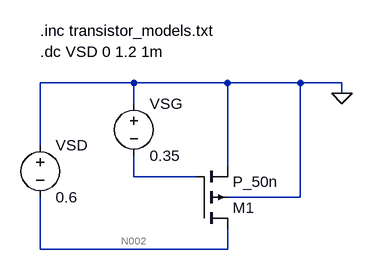
[diagram p0: schematic lab05_pmos_char.asc]
lab05_pmos_char.asc, the LTspice schematic file:
Version 4
SHEET 1 880 680
WIRE 176 32 32 32
WIRE 320 32 176 32
WIRE 432 32 320 32
WIRE 496 32 432 32
WIRE 496 48 496 32
WIRE 176 64 176 32
WIRE 32 128 32 32
WIRE 320 160 320 32
WIRE 176 176 176 144
WIRE 272 176 176 176
WIRE 432 208 432 32
WIRE 432 208 320 208
WIRE 32 288 32 208
WIRE 320 288 320 256
WIRE 320 288 32 288
FLAG 496 48 0
SYMBOL voltage 32 112 R0
WINDOW 123 0 0 Left 0
WINDOW 39 0 0 Left 0
SYMATTR InstName VSD
SYMATTR Value 0.6
SYMBOL voltage 176 48 R0
WINDOW 123 0 0 Left 0
WINDOW 39 0 0 Left 0
SYMATTR InstName VSG
SYMATTR Value 0.35
SYMBOL pmos4 272 256 M180
SYMATTR InstName M1
SYMATTR Value P_50n
SYMATTR Value2 l=1u w=10u
TEXT 32 -48 Left 2 !.inc transistor_models.txt
TEXT 32 -16 Left 2 !.dc VSD 0 1.2 1m

The netlist it stands for:
* lab05_pmos_char.asc
VSD 0 N002 0.6
VSG 0 N001 0.35
M1 N002 N001 0 0 P_50n l=1u w=10u
.model NMOS NMOS
.model PMOS PMOS
.lib standard.mos
.inc transistor_models.txt
.dc VSD 0 1.2 1m
.backanno
.end

* Results of the author's LTspice run, read from the files saved beside the schematic
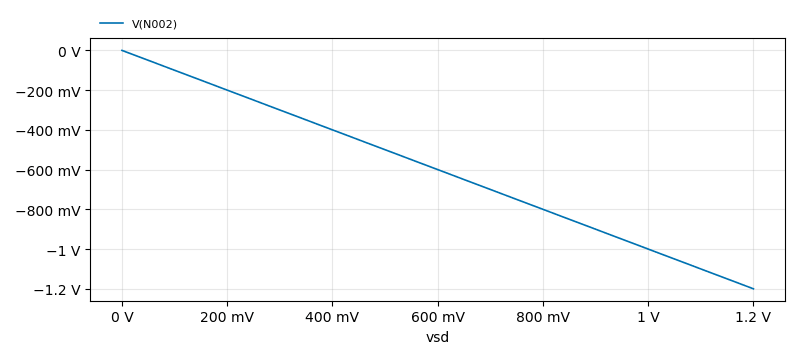
[diagram p1: DC transfer characteristic of lab05_pmos_char.asc, plotted from the saved traces]
* DC transfer characteristic, 1 run:
*   V(N002): 0 V at vsd=0 V, -1.2 V at vsd=1.2 V, min -1.2 V, max 0 V